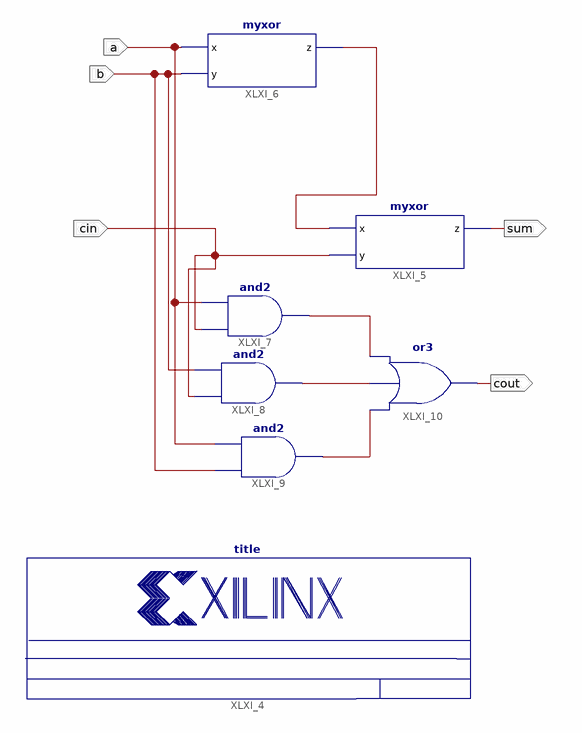
[diagram p0: schematic sheet 1]
// Xilinx ISE schematic fuller_adder_sch.sch (spartan3e) as structural Verilog: 7 symbols, 5 ports
module fuller_adder_sch (
  input  a,
  input  b,
  input  cin,
  output sum,
  output cout
);

  wire XLXN_11, XLXN_12, XLXN_17, XLXN_24;

  title #(.NameFieldText("Full adder")) XLXI_4 ();
  myxor XLXI_5 (.x(XLXN_24), .y(cin), .z(sum));
  and XLXI_7 (XLXN_11, cin, a);
  and XLXI_8 (XLXN_12, cin, b);
  and XLXI_9 (XLXN_17, b, a);
  or XLXI_10 (cout, XLXN_17, XLXN_12, XLXN_11);
  myxor XLXI_6 (.x(a), .y(b), .z(XLXN_24));
endmodule
